# Altium schematic sheet SatBusConnections.SchDoc: SunS - PW-Sat2 connections
size A3; Author: Michał Gumiela; DocumentNumber: 16; SheetNumber: 16; SheetTotal: 16; Model: EM1; PageSetup: Record=PageOptions|CenterHorizontal=True|CenterVertical=True|PrintScale=0.52|XCorrection=1.00|YCorrection=1.00|PrintKind=1|BorderSize=5000000|LeftOffset=0|BottomOffset=0|Orientation=2|PaperLength=4200|PaperWidth=2970|Scale=100|PaperSource=7|PrintQuality=600|MediaType=1|DitherType=10|PaperKind=A3|PrintScaleMode=1
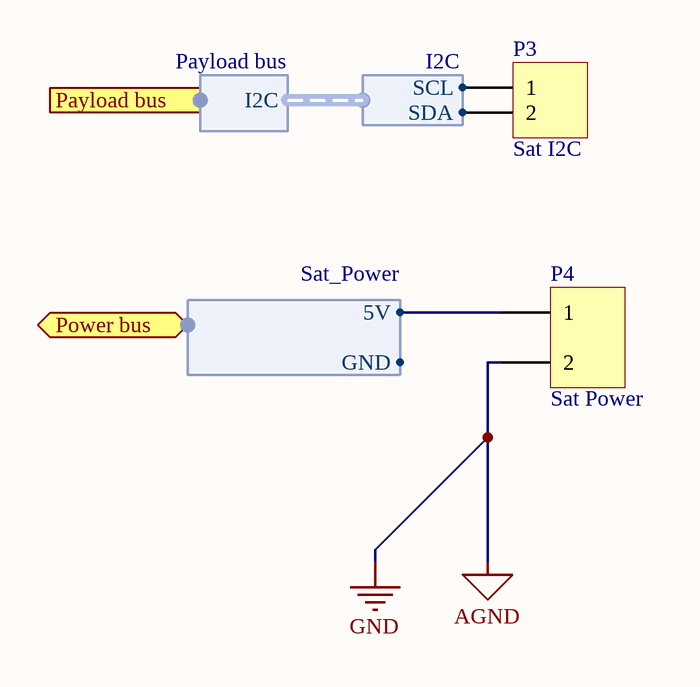
[diagram p0: SatBusConnections.SchDoc]

## Parts
P3  Sat I2C  [HDR1X2]
P4  Sat Power  [HDR1X3]

## Ports
Payload bus (harness Payload bus), Power bus (harness Sat_Power)

## Harnesses
I2C: SCL, SDA
Payload bus: I2C
Sat_Power: 5V, GND

## Nets
AGND: P4.3(2)  [also labelled GND]
NetP3_1: P3.1 ; harness I2C.SCL
NetP3_2: P3.2 ; harness I2C.SDA
NetP4_1: P4.1 ; port Power bus.5V

Not connected (* = marked no-connect by the designer): P4 2

## Notes on the sheet
- Title:
- Sheet:
- of
- Author:
- Model:
- Document Number:
- Checked by:
- Iss-Rev:
- Approved by:
- Date:
- File name:

## Library data of the parts
P3 = Header 2: Header, 2-Pin; LatestRevisionDate: 17-Jul-2002; LatestRevisionNote: Re-released for DXP Platform.; Publisher: Altium Limited
P4 = Header 3: Header, 3-Pin; LatestRevisionDate: 17-Jul-2002; LatestRevisionNote: Re-released for DXP Platform.; Publisher: Altium Limited